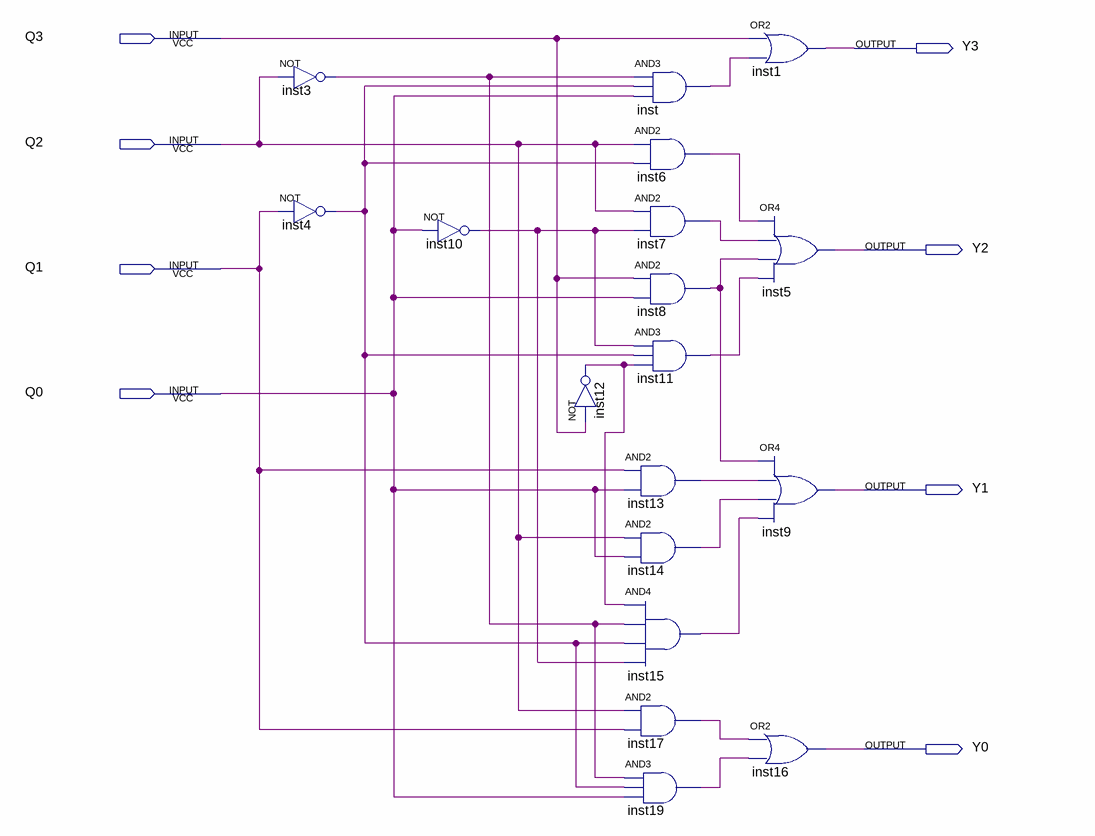
[diagram p0: schematic sheet]
// Quartus schematic Saida.bdf as structural Verilog: 18 symbols, 8 pins
module Saida (
  input  Q3,
  input  Q2,
  input  Q1,
  input  Q0,
  output Y3,
  output Y2,
  output Y1,
  output Y0
);

  wire inst3_out, inst4_out, inst6_out, inst7_out, inst8_out, inst10_out, inst11_out, inst12_out, inst13_out,
       inst14_out, inst15_out, inst17_out, inst19_out, inst_out;

  not inst3 (inst3_out, Q2);
  not inst4 (inst4_out, Q1);
  not inst10 (inst10_out, Q0);
  not inst12 (inst12_out, Q3);
  and inst (inst_out, inst3_out, inst4_out, Q0);
  and inst6 (inst6_out, Q2, inst4_out);
  and inst7 (inst7_out, Q2, inst10_out);
  and inst8 (inst8_out, Q3, Q0);
  and inst11 (inst11_out, inst10_out, inst4_out, inst12_out);
  and inst13 (inst13_out, Q1, Q0);
  and inst14 (inst14_out, Q2, Q0);
  and inst15 (inst15_out, inst12_out, inst3_out, inst4_out, inst10_out);
  and inst17 (inst17_out, Q2, Q1);
  and inst19 (inst19_out, inst3_out, inst4_out, Q0);
  or inst1 (Y3, Q3, inst_out);
  or inst5 (Y2, inst6_out, inst7_out, inst8_out, inst11_out);
  or inst9 (Y1, inst8_out, inst13_out, inst14_out, inst15_out);
  or inst16 (Y0, inst17_out, inst19_out);
endmodule
